# Altium schematic sheet 74HC595.SchDoc
size A4
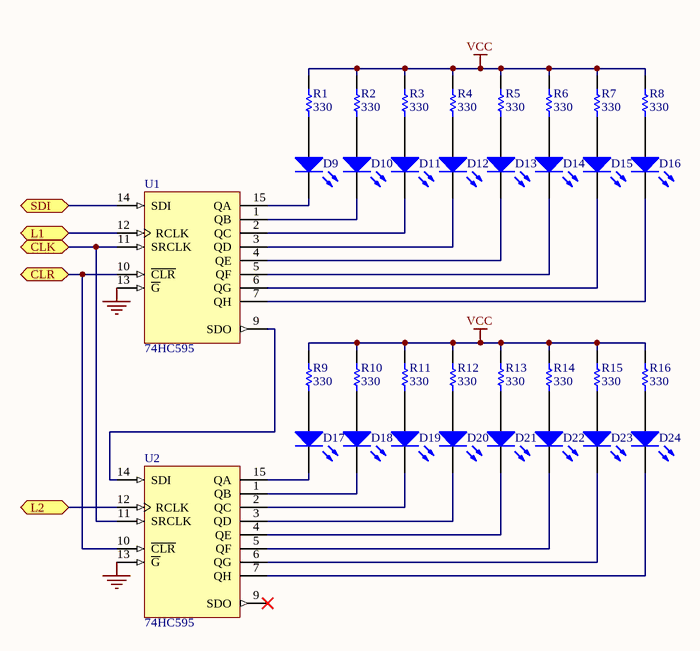
[diagram p0: 74HC595.SchDoc]

## Parts
D9  LED0  [CAPPR2-5X6.8]  (value not drawn)
D10  LED0  [CAPPR2-5X6.8]  (value not drawn)
D11  LED0  [CAPPR2-5X6.8]  (value not drawn)
D12  LED0  [CAPPR2-5X6.8]  (value not drawn)
D13  LED0  [CAPPR2-5X6.8]  (value not drawn)
D14  LED0  [CAPPR2-5X6.8]  (value not drawn)
D15  LED0  [CAPPR2-5X6.8]  (value not drawn)
D16  LED0  [CAPPR2-5X6.8]  (value not drawn)
D17  LED0  [CAPPR2-5X6.8]  (value not drawn)
D18  LED0  [CAPPR2-5X6.8]  (value not drawn)
D19  LED0  [CAPPR2-5X6.8]  (value not drawn)
D20  LED0  [CAPPR2-5X6.8]  (value not drawn)
D21  LED0  [CAPPR2-5X6.8]  (value not drawn)
D22  LED0  [CAPPR2-5X6.8]  (value not drawn)
D23  LED0  [CAPPR2-5X6.8]  (value not drawn)
D24  LED0  [CAPPR2-5X6.8]  (value not drawn)
R1  330  [CAPC2012L]
R2  330  [CAPC2012L]
R3  330  [CAPC2012L]
R4  330  [CAPC2012L]
R5  330  [CAPC2012L]
R6  330  [CAPC2012L]
R7  330  [CAPC2012L]
R8  330  [CAPC2012L]
R9  330  [CAPC2012L]
R10  330  [CAPC2012L]
R11  330  [CAPC2012L]
R12  330  [CAPC2012L]
R13  330  [CAPC2012L]
R14  330  [CAPC2012L]
R15  330  [CAPC2012L]
R16  330  [CAPC2012L]
U1  74HC595  [DIP16]
U2  74HC595  [DIP16]

## Ports
CLK (bidir), CLR (bidir), L1 (bidir), L2 (bidir), SDI (bidir)

## Nets
GND: U1.8(GND) U1.13(~{G}) U2.8(GND) U2.13(~{G})
VCC: R1.2 R2.2 R3.2 R4.2 R5.2 R6.2 R7.2 R8.2 R9.2 R10.2 R11.2 R12.2 R13.2 R14.2 R15.2 R16.2 U1.16(VCC) U2.16(VCC)
CLK: U1.11(SRCLK) U2.11(SRCLK) ; port CLK
CLR: U1.10(~{CLR}) U2.10(~{CLR}) ; port CLR
L1: U1.12(RCLK) ; port L1
L2: U2.12(RCLK) ; port L2
SDI: U1.14(SDI) ; port SDI
NetD9_1: D9.1(A) R1.1
NetD9_2: D9.2(K) U1.15(QA)
NetD10_1: D10.1(A) R2.1
NetD10_2: D10.2(K) U1.1(QB)
NetD11_1: D11.1(A) R3.1
NetD11_2: D11.2(K) U1.2(QC)
NetD12_1: D12.1(A) R4.1
NetD12_2: D12.2(K) U1.3(QD)
NetD13_1: D13.1(A) R5.1
NetD13_2: D13.2(K) U1.4(QE)
NetD14_1: D14.1(A) R6.1
NetD14_2: D14.2(K) U1.5(QF)
NetD15_1: D15.1(A) R7.1
NetD15_2: D15.2(K) U1.6(QG)
NetD16_1: D16.1(A) R8.1
NetD16_2: D16.2(K) U1.7(QH)
NetD17_1: D17.1(A) R9.1
NetD17_2: D17.2(K) U2.15(QA)
NetD18_1: D18.1(A) R10.1
NetD18_2: D18.2(K) U2.1(QB)
NetD19_1: D19.1(A) R11.1
NetD19_2: D19.2(K) U2.2(QC)
NetD20_1: D20.1(A) R12.1
NetD20_2: D20.2(K) U2.3(QD)
NetD21_1: D21.1(A) R13.1
NetD21_2: D21.2(K) U2.4(QE)
NetD22_1: D22.1(A) R14.1
NetD22_2: D22.2(K) U2.5(QF)
NetD23_1: D23.1(A) R15.1
NetD23_2: D23.2(K) U2.6(QG)
NetD24_1: D24.1(A) R16.1
NetD24_2: D24.2(K) U2.7(QH)
NetU1_9: U1.9(SDO) U2.14(SDI)

Not connected (* = marked no-connect by the designer): U2 9(SDO)*

## Library data of the parts
D9-D24 = LED0: Typical INFRARED GaAs LED; Published: 8-Jun-2000; LatestRevisionDate: 08-Jul-2005; LatestRevisionNote: Mech Layer 1 removed.; PackageReference: LED-0; Publisher: Altium Limited
R1-R16 = Res1: Resistor; Value: 1K; Published: 8-Jun-2000; LatestRevisionDate: 17-Jul-2002; LatestRevisionNote: Re-released for DXP Platform.; PackageReference: AXIAL-0.3; Publisher: Altium Limited
U1 U2 = M74HC595B1R: 8 Bit Shift Register with Output Latches (3 STATE); Published: 8-Jun-2000; LatestRevisionDate: 06-Jun-2005; LatestRevisionNote: Stylized 3D Model Added.; DatasheetVersion: Apr-1993; PackageVersion: Apr-1996; PackageReference: DIP16; Publisher: Altium Limited; PackageDescription: DIP; 16 Leads; Row Spacing 7.62 mm; Pitch 2.54 mm; ComponentLink1Description: Manufacturer Link; ComponentLink1URL: http://www.st.com/; ComponentLink2Description: Datasheet; ComponentLink2URL: http://www.st.com/stonline/products/literature/ds/1989/m74hc595.pdf